# EAGLE design USB_Current_Sensor (EAGLE 9.6.2)
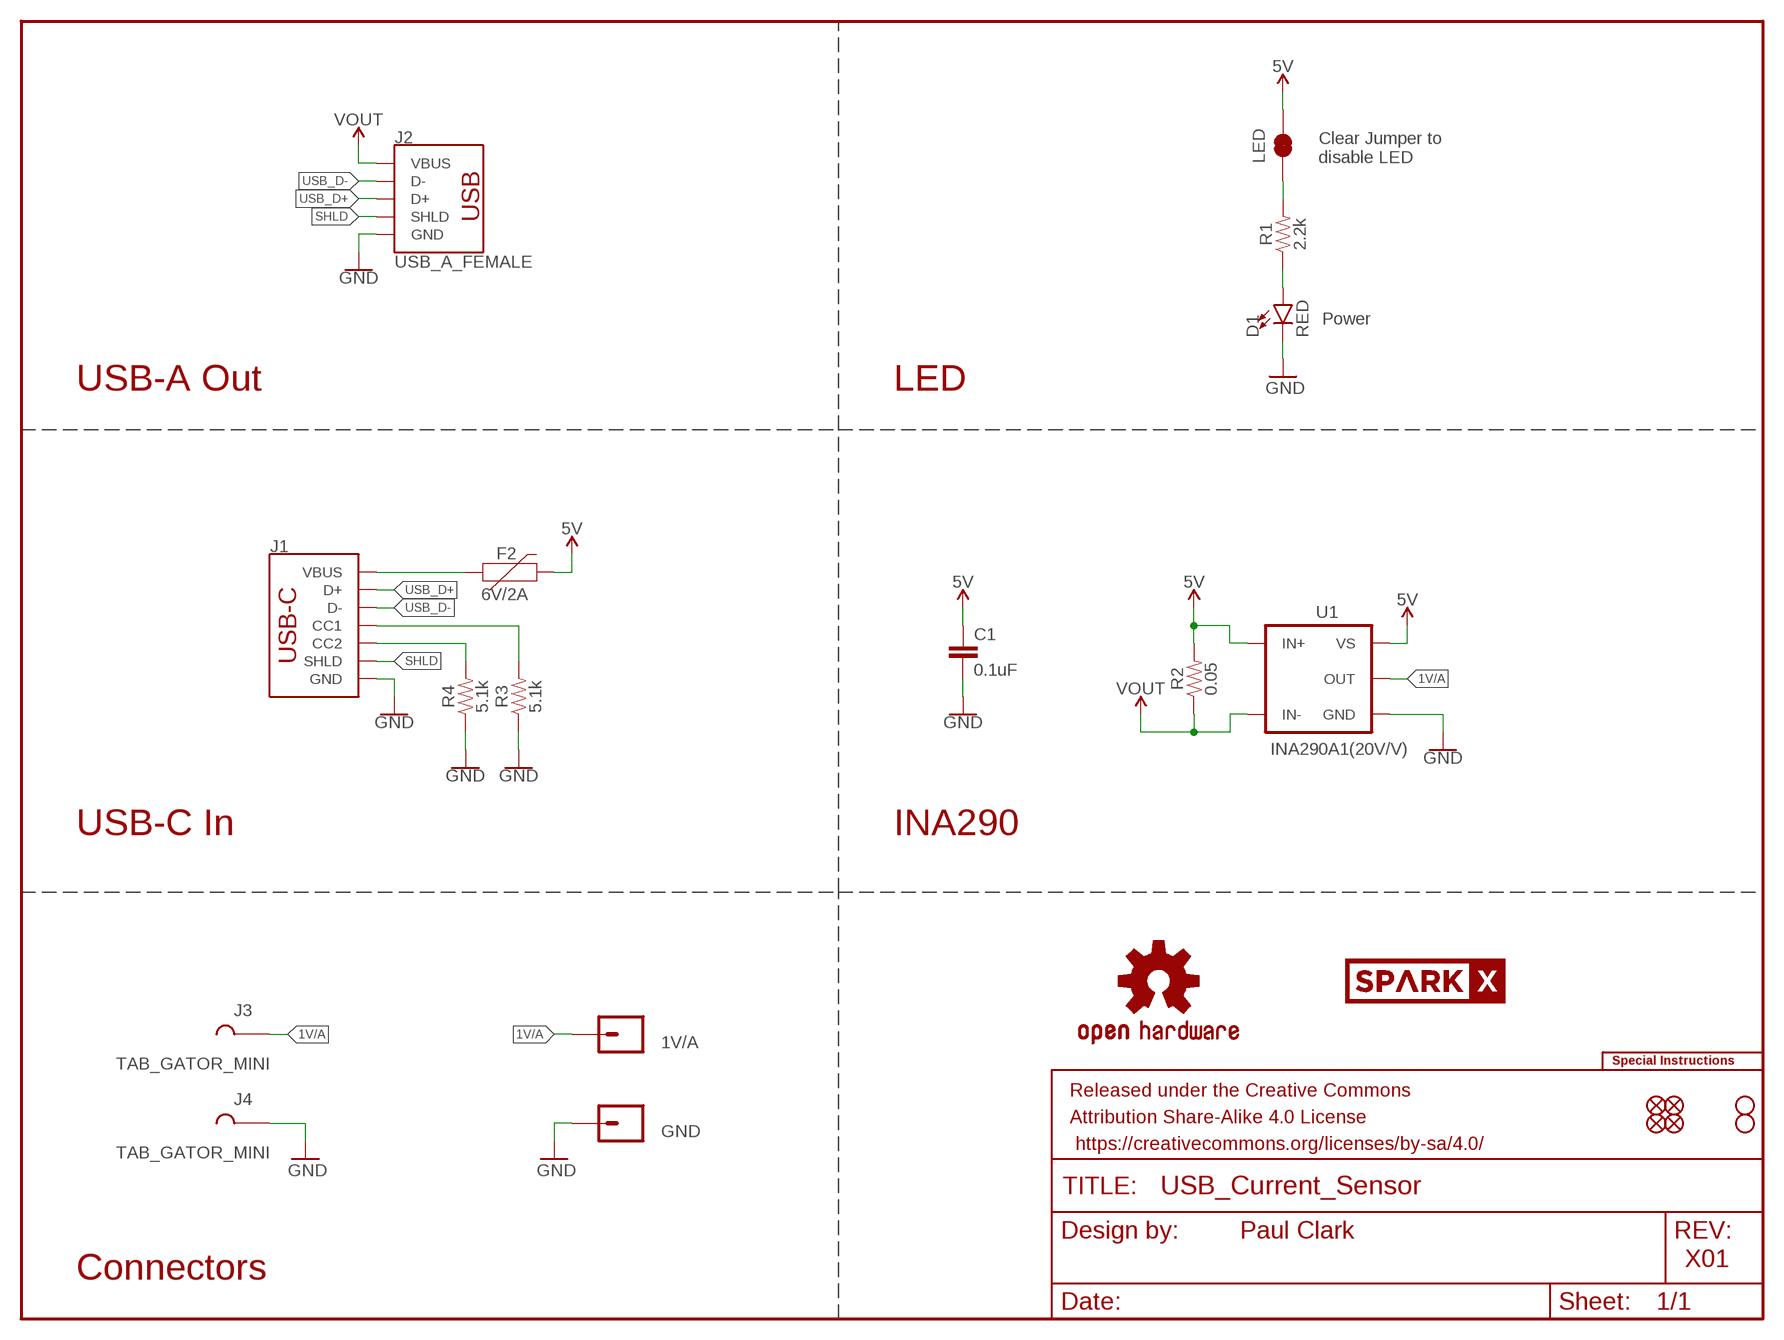
[diagram p0: schematic, sheet 1]

## Parts
1V/A  CONN_01PTH_NO_SILK_YES_STOP  [1X01_NO_SILK]
C1  0.1uF  0.1UF-0603-25V-(+80/-20%)  [0603]
D1  RED  LED-RED0603  [LED-0603]
F2  6V/2A  PPTC_6V2A  [1210]
FRAME1  FRAME-LETTER  [CREATIVE_COMMONS]
GND  CONN_01PTH_NO_SILK_YES_STOP  [1X01_NO_SILK]
J1  USB_C_4-LAYER_PADS  [USB-C-16P_4LAYER-PADS]
J2  USB_A_FEMALE  USB_A_SMT_FEMALE_NS  [USB-A-S-NOSILK-FEMALE]
J3  TAB_GATOR_MINI  [TAB_GATOR_MINI]
J4  TAB_GATOR_MINI  [TAB_GATOR_MINI]
JP1  FIDUCIAL1X2  [FIDUCIAL-1X2]
JP2  FIDUCIAL1X2  [FIDUCIAL-1X2]
JP3  STAND-OFF  [STAND-OFF]
JP4  STAND-OFF  [STAND-OFF]
JP5  FIDUCIAL1X2  [FIDUCIAL-1X2]
JP6  FIDUCIAL1X2  [FIDUCIAL-1X2]
LED  JUMPER-SMT_2_NC_TRACE_SILK  [SMT-JUMPER_2_NC_TRACE_SILK]
LOGO1  OSHW-LOGOMINI  [OSHW-LOGO-MINI]
LOGO2  SPECIAL_INSTRUCTIONS-ORDERING  [ORDERING_INSTRUCTIONS]
R1  2.2k  2.2KOHM-0603-1/10W-1%  [0603]
R2  0.05  0.05OHM-0603-1/5W-1%  [0603]
R3  5.1k  5.1KOHM5.1KOHM-0603-1/10W-1%  [0603]
R4  5.1k  5.1KOHM5.1KOHM-0603-1/10W-1%  [0603]
U1  INA290A1(20V/V)  [SC70]
U$2  SPARKX-LOGO4  [SPARKX-MEDIUM]

## Nets
1V/A: 1V/A.1 J3.P1 U1.1(OUT)
5V: C1.1 F2.2 LED.2 R2.2 U1.3(VS) U1.4(IN+)
GND: C1.2 D1.C GND.1 J1.GND J1.GND2(GND) J2.GND J4.P1 R3.1 R4.1 U1.2(GND)
N$3: D1.A R1.1
N$4: LED.1 R1.2
N$10: J1.A5(CC1) R3.2
N$11: J1.B5(CC2) R4.2
N$19: F2.1 J1.VBUS1(VBUS) J1.VBUS2(VBUS)
SHLD: J1.SHLD1(SHLD) J1.SHLD2(SHLD) J1.SHLD3(SHLD) J1.SHLD4(SHLD) J2.SHLD1(SHLD) J2.SHLD2(SHLD)
USB_D+: J1.A6(D+) J1.B6(D+) J2.D+
USB_D-: J1.A7(D-) J1.B7(D-) J2.D-
VOUT: J2.VBUS R2.1 U1.5(IN-)

## Notes on the sheet
- Clear Jumper to 
  disable LED
- Power
- USB-A Out | LED
- USB-C In | INA290
- Paul Clark
- X01
- Connectors

## Library data of the parts
1V/A GND = SparkFun-Connectors:CONN_01: Single connection point. Often used as Generic Header-pin footprint for 0.1 inch spaced/style header connections On any of the 0.1 inch spaced packages, you can populate with these: Break Away Headers - Straight <https://www.sparkfun.com/products/116> (PRT-00116) Break Away Male Headers - Right Angle <https://www.sparkfun.com/products/553> (PRT-00553) Female Headers <https://www.sparkfun.com/products/115> (PRT-00115) Break Away Headers - Machine Pin <https://www.sparkfun.com/products/117> (PRT-00117) Break Away Female Headers - Swiss Machine Pin <https://www.sparkfun.com/products/743> (PRT-00743) This device is also useful as a general connection point to wire up your design to another part of your project. Our various solder wires solder well into these plated through hole pads. Hook-Up Wire - Assortment (Stranded, 22 AWG) <https://www.sparkfun.com/products/11375> (PRT-11375) Hook-Up Wire - Assortment (Solid Core, 22 AWG) <https://www.sparkfun.com/products/11367> (PRT-11367) View the entire wire category on our website here <https://www.sparkfun.com/categories/141> Special notes: SMTSO-256-ET is a "flush mount" nut for a 4-40 screw. We mostly use this on specialty testbeds; it is a nice way to connect hardware to your PCB at an adjustable hieght. Also note, the SNAP packages are for using a snappable style connector. We sell a baggie of snaps and they are also used on two LilyPad designs: Snap Assortment - 30 pack (male and female) <https://www.sparkfun.com/products/11347> (DEV-11347) LilyPad Arduino SimpleSnap <https://www.sparkfun.com/products/10941> (DEV-10941) LilyPad SimpleSnap Protoboard <https://www.sparkfun.com/products/10940> (DEV-10940)
C1 = SparkFun-Capacitors:0.1UF: 0.1µF ceramic capacitors A capacitor is a passive two-terminal electrical component used to store electrical energy temporarily in an electric field.; PROD_ID: CAP-00810
D1 = SparkFun-LED:LED-RED: Red SMD LED Used in manufacturing of most products at SparkFun Packages: 0603 - SMD 0603 package [Product Link] <http://docs.avagotech.com/docs/AV02-0551EN> 0603 SMART - SMD 0603 SMART package ( more efficient and expensive)[Product Link] <http://www.osram-os.com/Graphics/XPic2/00077099_0.pdf> 1206 - SMD1206 package [Product Link] <https://www.sparkfun.com/datasheets/DevTools/LilyPad/Q150OVS4.pdff> SparkFun Products: Pro Mini 328 -5V <https://www.sparkfun.com/products/821> RedBoard <https://www.sparkfun.com/products/12757> IOIO-OTG <https://www.sparkfun.com/products/13613>; PROD_ID: DIO-00819
F2 = SparkFun-Fuses:PPTC: Resettable Fuse PPTC Resettable Fuse. Really a sort of resistor with a polymeric positive temperature coefficient whose resistance increases dramatically with an increase in temperature. When heated by the power passing through the resistance rises causing the current to be limited, protecting the circuit. This is achieved by the transition of the polymer from a crystalline to an amorphous state where the conductive carbon separates breaking the conductive pathways found in the cool crystalline structure. When a PPTC cools back down it resumes conducting letting the circuit turn back on. SparkFun Products: SparkFun RedBoard - Programmed with Arduino <https://www.sparkfun.com/products/12757> Pro Micro - 5V/16MHz <https://www.sparkfun.com/products/12640> Arduino Pro 328 - 5V/16MHz <https://www.sparkfun.com/products/10915> MP3 Trigger <https://www.sparkfun.com/products/13720>; PROD_ID: RES-14313
FRAME1 = SparkFun-Aesthetics:FRAME-LETTER: Schematic Frame - Letter Standard 8.5x11 US Letter frame
J1 = SparkFun-Connectors:USB_C: USB Type C 16Pin Connector Super Speed pins not available on the 16-pin purely SMD connector so this part is best for USB 2.0 implementations. D1 and D2 are tied together enabling D+/- no matter which way the cable is plugged into the connector. The two channel configuration pins (CC1/2) are exposed. These are normally connected to ground via 5.1k resistors but can be reconfigured for high current/high power applications. **4-LAYER BOARD WARNING!!** If designing 4-layer board, make sure to select the variant _4-LAYER-ISOLATED. The linked footprint (USB-C-16-4LAYER-ISOLATED) includes some very necessary cutout polygons in the inner layers (2 and 15). This prevents the PTH mounting shield legs on the USB connector from electrically connecting any other polygons on the inner layers (usually VCC and GND).; PROD_ID: CONN-14122
J2 = SparkFun-Connectors:USB_A: USB-A Connector Male and female variants, as well as PTH and SMT variants SparkFun Products: SparkFun XBee Explorer Dongle <https://www.sparkfun.com/products/11697> PTH Male SparkFun MicroView-USB Programmer <https://www.sparkfun.com/products/12924> SMT Male SparkFun USB Type A Female Breakout <https://www.sparkfun.com/products/12700> SMT Female; PROD_ID: CONN-09520; SF_ID: PRT-09011
J3 J4 = SparkFun-Connectors:TAB_GATOR_MINI
JP1 JP2 JP5 JP6 = SparkFun-Aesthetics:FIDUCIAL: Fiducial Alignment Points Point-of-reference for pick-and-place machines and other optical instruments.
JP3 JP4 = SparkFun-Hardware:STAND-OFF: Stand Off Drill holes for mechanically mounting via screws, standoffs, etc. Note: Use the keepout ring to avoid running the screw head into surrounding components. Variant Overviews STAND-OFF - Mechanical footprint for a #4 phillips button head screw. STAND-OFF-TIGHT - Mechanical footprint for a #4 phillips button head screw, Example SparkFun Products Screw - Phillips Head (1/4", 4-40, 10 pack) <https://www.sparkfun.com/products/10453> (PRT-10453) Screw - Phillips Head (1/2", 4-40, 10 pack) <https://www.sparkfun.com/products/10452> (PRT-10452) Screw - Phillips Head (3/4", 4-40, 10 pack) <https://www.sparkfun.com/products/10451> (PRT-10451) Screw - Phillips Head (1", 4-40, 10 pack) <https://www.sparkfun.com/products/10450> (PRT-10450)
LED = SparkFun-Jumpers:JUMPER-SMT_2_NC_TRACE: Normally closed trace jumper This jumper has a trace between two pads so it's normally closed (NC). Use a razor knife to open the connection. For best results follow the IPC guidelines for cutting traces: Cutout at least 0.063 mm (0.005 in). Remove all loose material to clean up the cut area. Seal the cut with an approved epoxy. Reapply solder to reclose the connection.
LOGO1 = SparkFun-Aesthetics:OSHW-LOGO: Open-Source Hardware (OSHW) Logo This logo indicates the piece of hardware it is found on incorporates a OSHW license and/or adheres to the definition of open source hardware found here: http://freedomdefined.org/OSHW
LOGO2 = SparkFun-Aesthetics:SPECIAL_INSTRUCTIONS: Special Ordering/Production Instructions Alert Symbol for special PCB ordering instructions or unique production process warnings. Ordering Instructions Production Instructions Types of information that should be added to box: Copper weight Soldermask color Silk color PCB thickness Number of layers PCB Standard: 1.6mm FR4 1 oz copper immersion silver plating red soldermask white silkscreen Types of information that should be added to box: Special wash requirements Depaneling instructions Humidification Glue curing Default text settings: 0.07 inch 9% ratio 50% line distance
R1 = SparkFun-Resistors:2.2KOHM: 2.2kΩ resistor A resistor is a passive two-terminal electrical component that implements electrical resistance as a circuit element. Resistors act to reduce current flow, and, at the same time, act to lower voltage levels within circuits. - Wikipedia; PROD_ID: RES-08272
R2 = SparkFun-Resistors:0.05OHM: 0.05Ω resistor A resistor is a passive two-terminal electrical component that implements electrical resistance as a circuit element. Resistors act to reduce current flow, and, at the same time, act to lower voltage levels within circuits. - Wikipedia; PROD_ID: RES-12535
R3 R4 = SparkFun-Resistors:5.1KOHM; PROD_ID: RES-12083
U1 = New_Parts:INA290: Current-Sense Amplifier - INA290 INA290 2.7-V to 120-V, 1.1-MHz, Ultra-Precise Current-Sense Amplifier in Small (SC-70) Package Datasheet <https://cdn.sparkfun.com/assets/8/e/a/1/f/DS-17044-Ultra-Precise_Current_Sense_Amplifier_-_20_V_V_Gain.pdf>; PROD_ID: IC-15832
U$2 = SparkX:SPARKX-LOGO

## Net classes
1 power: width 0.203 mm

## Board
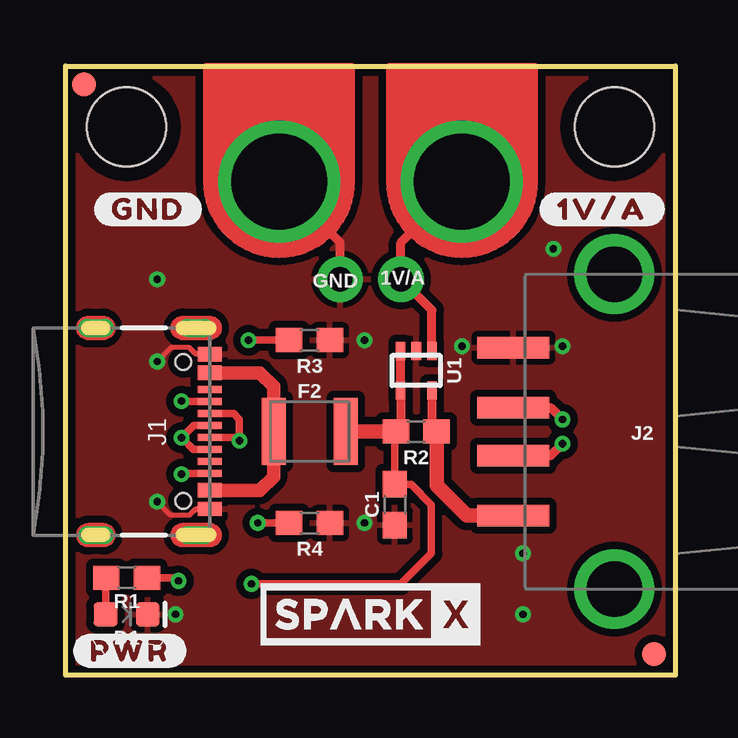
[diagram p1: board, top side]
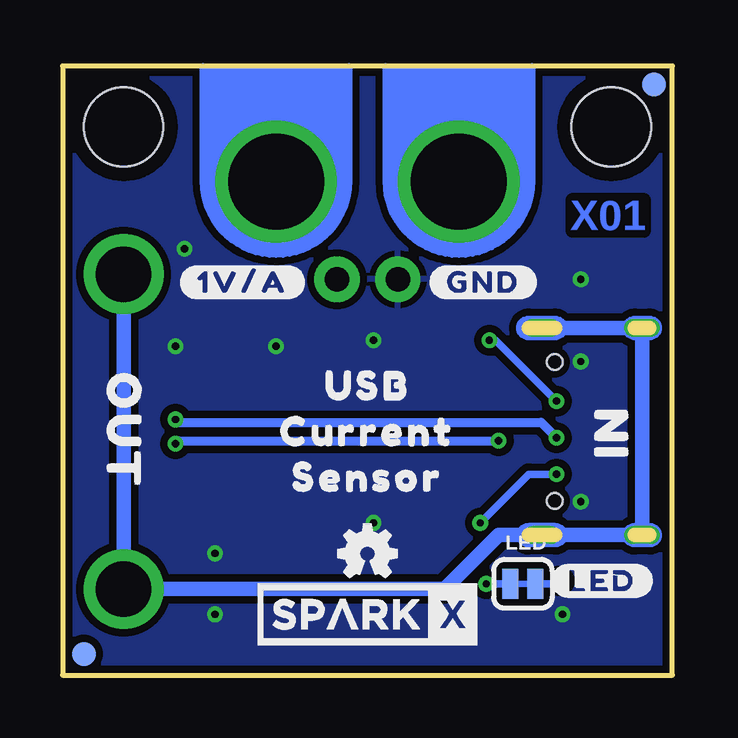
[diagram p2: board, bottom side, seen from below]

Size 25.4 x 25.4 mm. Coordinates in mm from the lower left corner, seen from the top.
Outline: 25.4,25.4 25.4,0 0,0 0,25.4 25.4,25.4
Copper layers (1*16): Top 0.035mm / dielectric 1.5mm / Bottom 0.035mm
Design rules "SparkFun-2-Layer-General-JLCPCB": minimum track width 7mil, minimum drill 0.3mm, track to track 7mil, track to pad 7mil, pad to pad 7mil, via to via 7mil, smd to smd 7mil, copper to edge 7mil, drill to drill 7mil, minimum pad ring 7mil, minimum via ring 7mil, stop-mask expansion 3mil, vias tented up to drill 25mil, thermal gap 10mil

### Footprints (pad centres in the part's own frame; a part is rotated, then mirrored left to right if it is on the bottom)
1X01_NO_SILK = drill 1.016 pad 1.88: 1 0,0
0603 = smd 1.1 x 1: 1 -0.85,0; 2 0.85,0
LED-0603 = smd 1 x 1: A -0.877,0; C 0.877,0
1210 = smd 1 x 2.8: 1 -1.5,0; 2 1.5,0
USB-C-16P_4LAYER-PADS = smd 0.3 x 1: A5 -1.25,-0.34; A6 -0.25,-0.34; A7 0.25,-0.34; A8 1.25,-0.34; B5 1.75,-0.34; B6 0.75,-0.34; B7 -0.75,-0.34; B8 -1.75,-0.34 | smd 0.6 x 1: GND -3.225,-0.34; GND2 3.225,-0.34; VBUS1 -2.45,-0.34; VBUS2 2.45,-0.34 | drill 0.4 pad 0.6 long: SHLD1 -4.318,-0.915; SHLD2 4.318,-0.915; SHLD3 -4.318,-5.095; SHLD4 4.318,-5.095 | hole 0.65: -2.89,-1.445; 2.89,-1.445
USB-A-S-NOSILK-FEMALE = smd 3 x 0.9: D+ 6.752,-1; D- 6.752,1; GND 6.752,-3.5; VBUS 6.752,3.5 | drill 2.311: SHLD1 2.54,-6.566; SHLD2 2.54,6.566
TAB_GATOR_MINI = drill 4 pad 5.08: P1 0,4.826
FIDUCIAL-1X2 = smd 1 x 1: 1 0,0
STAND-OFF = hole 3.302: 0,0
SMT-JUMPER_2_NC_TRACE_SILK = smd 0.66 x 1.27: 1 -0.521,0; 2 0.521,0
SC70 = smd 0.4 x 0.75: 1 -0.65,-0.825; 2 0,-0.825; 3 0.65,-0.825; 4 0.65,0.825; 5 -0.65,0.825

### Placement (x,y rotation side)
1V/A  13.97,16.51 180 top
C1  13.72,7.11 270 top
D1  2.54,2.54 0 top
F2  10.16,10.16 0 top
FRAME1  54.61,-10.16 0 top  (outside the outline)
GND  11.43,16.51 180 top
J1  6.35,10.16 270 top
J2  25.4,10.16 180 top
J3  16.51,25.4 180 top
J4  8.89,25.4 180 top
JP1  0.76,24.64 0 bottom
JP2  24.51,0.89 0 top
JP3  22.86,22.86 180 top
JP4  2.54,22.86 180 top
JP5  24.51,0.89 0 bottom
JP6  0.76,24.64 0 top
LED  6.22,3.81 180 bottom
LOGO1  12.7,5.08 0 bottom
LOGO2  34.29,50.8 0 top  (outside the outline)
R1  2.54,4.06 0 top
R2  14.61,10.16 180 top
R3  10.16,13.97 180 top
R4  10.16,6.35 180 top
U1  14.61,12.7 180 top
U$1  SPARKX-LOGO4  [SPARKX-MEDIUM]  12.7,2.54 0 top
U$2  12.7,2.54 0 bottom
U$3  [#GND#0]  3.43,19.43 0 top
U$4  [#GND#0]  7.87,16.38 0 bottom
U$5  [#1V#A#0]  22.35,19.43 0 top
U$6  [#1V#A#0]  17.91,16.38 0 bottom
U$7  [USB0]  12.7,12.06 0 bottom
U$8  [CURRENT0]  12.7,10.16 0 bottom
U$9  [SENSOR0]  12.7,8.26 0 bottom
U$10  [IN0]  2.54,10.16 90 bottom
U$11  [OUT0]  22.86,10.16 270 bottom
U$13  [#PWR#0]  2.67,1.02 0 top
U$14  [#LED#0]  2.92,3.94 0 bottom

### Tracks (layer width: path | path; a pad name or v marks a point on that pad's centre or on a via)
1V/A
  Top 0.381: U1.1 15.26,15.22 1V/A.1 13.97,18.03 J3.P1
5V  (via drill 0.3)
  Top 0.305: R2.2 13.72,10.12 C1.1 14.39,7.96 15.24,7.11 15.24,5.08 13.97,3.81 v7.75,3.81
  Top 0.381: R2.2 13.96,10.36 U1.4 U1.3
  Top 0.61: F2.2 R2.2
  Bottom 0.305: LED.2 v7.75,3.81
GND  (via drill 0.3)
  Top 0.203: J1.GND 5.42,13.38 5.16,13.65 4.38,13.65 v3.81,13.08 | J1.GND2 5.42,6.93 5.16,6.67 4.38,6.67 v3.81,7.24
  Top 0.381: GND.1 11.43,18.03 J4.P1
  other vias: 12.45,6.35 12.45,13.97 20.7,13.72 16.51,13.72 3.81,16.51 19.05,2.54 19.05,5.08 20.32,17.78 4.57,2.54
  pour Bottom (isolate 0.305): 25.4,25.4 25.4,0 0,0 0,25.4
  pour Top (isolate 0.305): 25.4,25.4 25.4,0 0,0 0,25.4
N$3
  Top 0.305: D1.A 1.66,4.04 R1.1
N$4  (via drill 0.3)
  Top 0.305: v4.7,3.94 4.57,4.06 R1.2
  Bottom 0.305: v4.7,3.94 4.83,3.81 LED.1
N$10  (via drill 0.3)
  Top 0.305: R3.2 v7.62,13.97 | v4.83,11.43 4.85,11.41 J1.A5
  Bottom 0.305: v7.62,13.97 7.37,13.97 v4.83,11.43
N$11  (via drill 0.3)
  Top 0.305: R4.2 v8,6.35 | v4.83,8.38 4.85,8.41 J1.B5
  Bottom 0.305: v8,6.35 5.97,8.38 v4.83,8.38
N$19
  Top 0.559: J1.VBUS1 8.09,12.61 8.66,12.04 F2.1 8.66,8.28 8.09,7.71 J1.VBUS2
SHLD
  Bottom 0.61: J2.SHLD1 J2.SHLD2 9.49,3.59 7.24,5.84 J1.SHLD2 J1.SHLD4 J1.SHLD3 J1.SHLD1
USB_D+  (via drill 0.3)
  Top 0.305: J1.A6 5.33,10.41 v4.83,9.91 5.32,9.41 J1.B6
  Top 0.381: J2.D+ 20.21,11.16 v20.7,10.67
  Bottom 0.381: v20.7,10.67 20.57,10.54 5.46,10.54 v4.83,9.91
USB_D-  (via drill 0.3)
  Top 0.305: J1.A7 7.11,9.91 v7.24,9.78 7.24,10.67 7,10.91 J1.B7
  Top 0.381: J2.D- 20.21,9.16 v20.7,9.65
  Bottom 0.381: v20.7,9.65 20.57,9.78 v7.24,9.78
VOUT
  Top 0.381: U1.5 15.26,10.36 R2.1
  Top 0.61: R2.1 15.46,7.91 16.71,6.66 J2.VBUS

### Text on the board
Bottom: X01
Measures: Dimensions in inches
tDocu: 2-Layer board / 1.6mm thickness / HASL finish | Paul Clark